# EAGLE design EEPROM-Programmer (EAGLE 9.6.2)
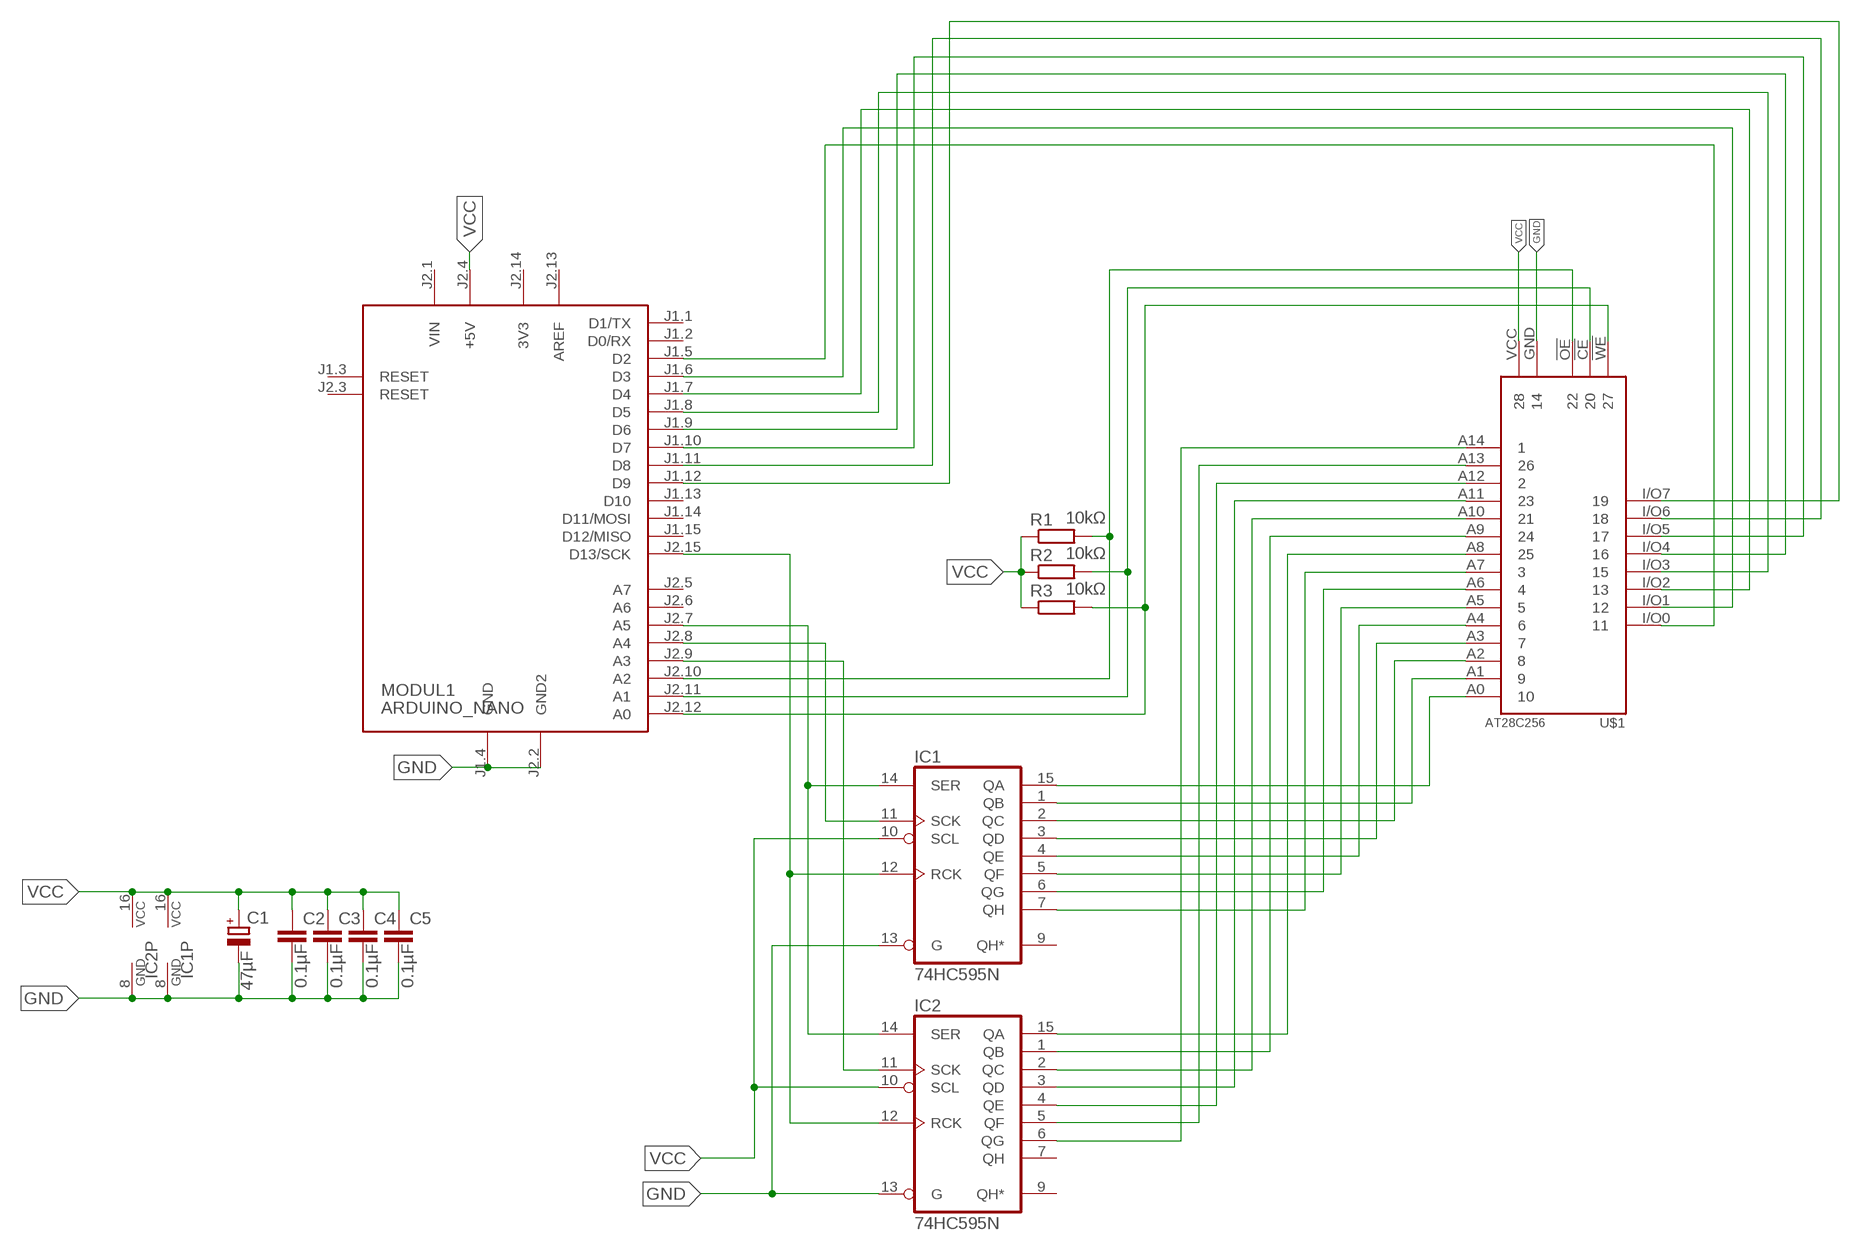
[diagram p0: schematic, sheet 1]

## Parts
C1  47µF  CPOL-EUE2,5-6E  [E2,5-6E]
C2  0.1µF  C2,5-3  [C2.5-3]
C3  0.1µF  C2,5-3  [C2.5-3]
C4  0.1µF  C2,5-3  [C2.5-3]
C5  0.1µF  C2,5-3  [C2.5-3]
IC1  74HC595N  [DIL16]
IC2  74HC595N  [DIL16]
MODUL1  ARDUINO_NANO  [ARDUINO_NANO2]
R1  10kΩ  R-EU_0204/7  [0204/7]
R2  10kΩ  R-EU_0204/7  [0204/7]
R3  10kΩ  R-EU_0204/7  [0204/7]
U$1  AT28C256  [AT28C256]

## Nets
GND: C1.- C2.2 C3.2 C4.2 C5.2 IC1.8(GND) IC1.13(G) IC2.8(GND) IC2.13(G) MODUL1.J1.4(GND) MODUL1.J2.2(GND2) U$1.GND
N$1: IC1.15(QA) U$1.A0
N$2: IC1.1(QB) U$1.A1
N$3: IC1.2(QC) U$1.A2
N$4: IC1.3(QD) U$1.A3
N$5: IC1.4(QE) U$1.A4
N$6: IC1.5(QF) U$1.A5
N$7: IC1.6(QG) U$1.A6
N$8: IC1.7(QH) U$1.A7
N$9: IC2.15(QA) U$1.A8
N$10: IC2.1(QB) U$1.A9
N$11: IC2.2(QC) U$1.A10
N$12: IC2.3(QD) U$1.A11
N$13: IC2.4(QE) U$1.A12
N$14: IC2.5(QF) U$1.A13
N$15: IC2.6(QG) U$1.A14
N$16: MODUL1.J1.5(D2) U$1.I/O0
N$17: MODUL1.J2.12(A0) R3.2 U$1.!WE
N$18: MODUL1.J1.6(D3) U$1.I/O1
N$19: MODUL1.J1.7(D4) U$1.I/O2
N$20: MODUL1.J1.8(D5) U$1.I/O3
N$21: MODUL1.J1.9(D6) U$1.I/O4
N$22: MODUL1.J1.10(D7) U$1.I/O5
N$23: MODUL1.J1.11(D8) U$1.I/O6
N$24: MODUL1.J1.12(D9) U$1.I/O7
N$25: MODUL1.J2.11(A1) R2.2 U$1.!CE
N$26: MODUL1.J2.10(A2) R1.2 U$1.!OE
N$27: IC2.11(SCK) MODUL1.J2.9(A3)
N$28: IC1.11(SCK) MODUL1.J2.8(A4)
N$29: IC1.14(SER) IC2.14(SER) MODUL1.J2.7(A5)
N$30: IC1.12(RCK) IC2.12(RCK) MODUL1.J2.15(D13/SCK)
VCC: C1.+ C2.1 C3.1 C4.1 C5.1 IC1.10(SCL) IC1.16(VCC) IC2.10(SCL) IC2.16(VCC) MODUL1.J2.4(+5V) R1.1 R2.1 R3.1 U$1.VCC
Unconnected: IC1.9(QH*) IC2.7(QH) IC2.9(QH*) MODUL1.J1.1(D1/TX) MODUL1.J1.2(D0/RX) MODUL1.J1.3(RESET) MODUL1.J1.13(D10) MODUL1.J1.14(D11/MOSI) MODUL1.J1.15(D12/MISO) MODUL1.J2.3(RESET) MODUL1.J2.5(A7) MODUL1.J2.6(A6)

## Power pins joined to a net without a drawn wire
3V3: MODUL1.J2.14(3V3)
AREF: MODUL1.J2.13(AREF)
VIN: MODUL1.J2.1(VIN)

## Library data of the parts
C1 = rcl:CPOL-EU: POLARIZED CAPACITOR, European symbol; SPICEPREFIX: C
C2-C5 = capacitor-wima:C: CAPACITOR naming: grid - package width
IC1 IC2 = 74xx-eu:74*595: 8-bit SHIFT REGISTER, output latch
MODUL1 = arduino:ARDUINO_NANO: Arduino Nano2 Auto generated by modulcreator.ulp \;; ANZAHL: 2; MODUL: TRUE; STECKX0: -76200; STECKX1: 76200; STECKY0: 177800; STECKY1: 177800
R1-R3 = rcl:R-EU_: RESISTOR, European symbol; SPICEPREFIX: R
U$1 = Dargon's_lib:AT28C256

## Board
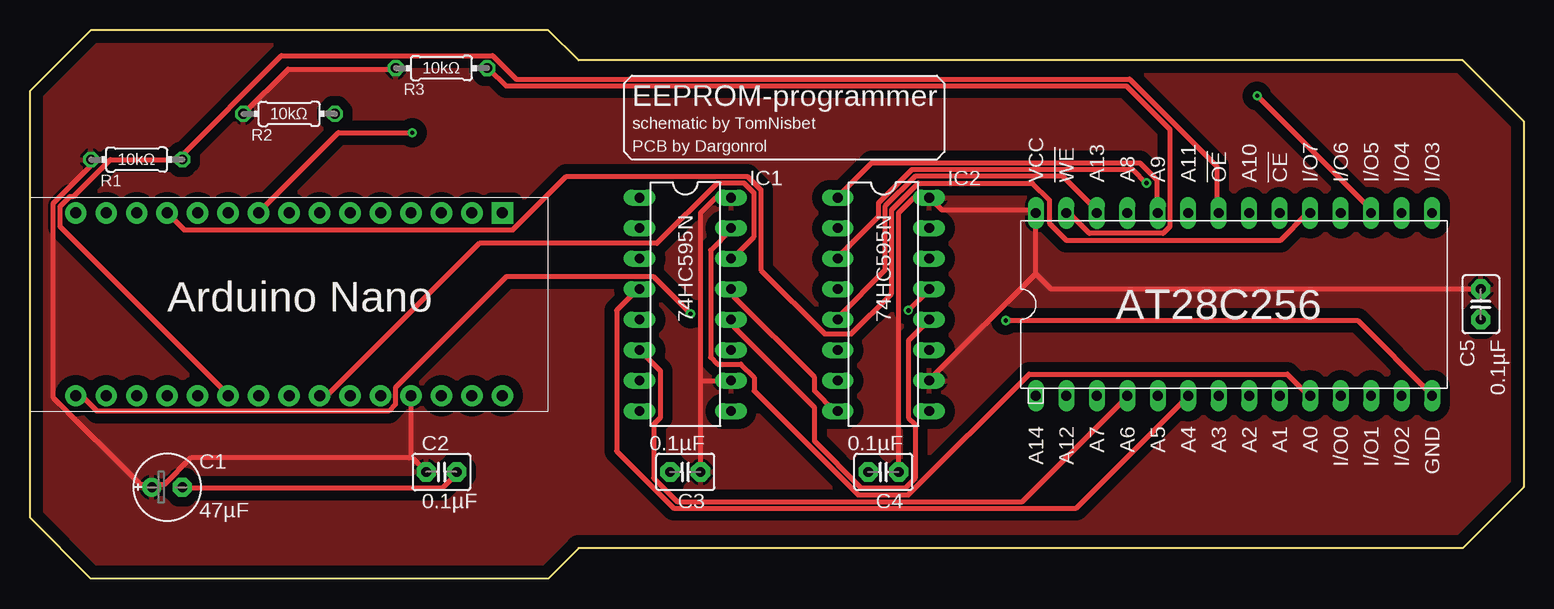
[diagram p1: board, top side]
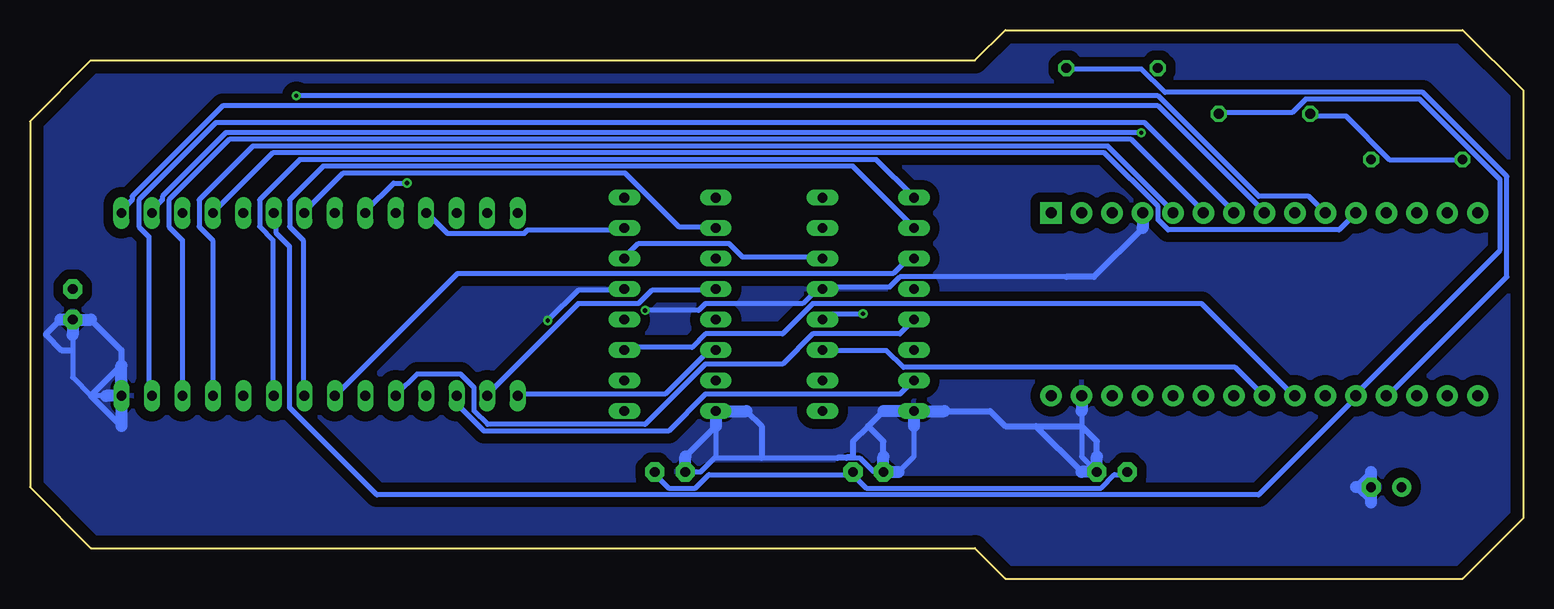
[diagram p2: board, bottom side, seen from below]

Size 124.46 x 45.72 mm. Coordinates in mm from the lower left corner, seen from the top.
Outline: 0,5.08 0,40.64 5.08,45.72 43.18,45.72 45.72,43.18 119.38,43.18 124.46,38.1 124.46,7.62 119.38,2.54 45.72,2.54 43.18,0 5.08,0 0,5.08
Copper layers (1*16): Top 0.035mm / dielectric 1.5mm / Bottom 0.035mm
Design rules "default *": minimum track width 16mil, minimum drill 0.35mm, track to track 6mil, track to pad 6mil, pad to pad 6mil, via to via 6mil, smd to smd 6mil, copper to edge 40mil, drill to drill 6mil, minimum pad ring 10mil, minimum via ring 8mil, stop-mask expansion 4mil, vias tented up to drill 0mil, thermal gap 10mil

### Footprints (pad centres in the part's own frame; a part is rotated, then mirrored left to right if it is on the bottom)
E2,5-6E = drill 0.813 pad 1.575: + -1.27,0 | drill 0.813 pad 1.575 octagon: - 1.27,0
C2.5-3 = drill 0.813 pad 1.6 octagon: 1 -1.27,0; 2 1.27,0
DIL16 = drill 0.813 long: 1 -8.89,-3.81; 2 -6.35,-3.81; 3 -3.81,-3.81; 4 -1.27,-3.81; 5 1.27,-3.81; 6 3.81,-3.81; 7 6.35,-3.81; 8 8.89,-3.81; 9 8.89,3.81; 10 6.35,3.81; 11 3.81,3.81; 12 1.27,3.81; 13 -1.27,3.81; 14 -3.81,3.81; 15 -6.35,3.81; 16 -8.89,3.81
ARDUINO_NANO2 = drill 0.914 pad 1.778 square: J1.1 -7.62,17.78 | drill 0.914 pad 1.778: J1.2 -7.62,15.24; J1.3 -7.62,12.7; J1.4 -7.62,10.16; J1.5 -7.62,7.62; J1.6 -7.62,5.08; J1.7 -7.62,2.54; J1.8 -7.62,0; J1.9 -7.62,-2.54; J1.10 -7.62,-5.08; J1.11 -7.62,-7.62; J1.12 -7.62,-10.16; J1.13 -7.62,-12.7; J1.14 -7.62,-15.24; J1.15 -7.62,-17.78; J2.1 7.62,17.78; J2.2 7.62,15.24; J2.3 7.62,12.7; J2.4 7.62,10.16; J2.5 7.62,7.62; J2.6 7.62,5.08; J2.7 7.62,2.54; J2.8 7.62,0; J2.9 7.62,-2.54; J2.10 7.62,-5.08; J2.11 7.62,-7.62; J2.12 7.62,-10.16; J2.13 7.62,-12.7; J2.14 7.62,-15.24; J2.15 7.62,-17.78
0204/7 = drill 0.813 octagon: 1 -3.81,0; 2 3.81,0
AT28C256 = drill 0.813 long: !CE 7.62,-5.08; !OE 7.62,0; !WE 7.62,12.7; A0 -7.62,-7.62; A1 -7.62,-5.08; A2 -7.62,-2.54; A3 -7.62,0; A4 -7.62,2.54; A5 -7.62,5.08; A6 -7.62,7.62; A7 -7.62,10.16; A8 7.62,7.62; A9 7.62,5.08; A10 7.62,-2.54; A11 7.62,2.54; A12 -7.62,12.7; A13 7.62,10.16; A14 -7.62,15.24; GND -7.62,-17.78; I/O0 -7.62,-10.16; I/O1 -7.62,-12.7; I/O2 -7.62,-15.24; I/O3 7.62,-17.78; I/O4 7.62,-15.24; I/O5 7.62,-12.7; I/O6 7.62,-10.16; I/O7 7.62,-7.62; VCC 7.62,15.24

### Placement (x,y rotation side)
C1  11.43,7.62 0 top
C2  34.29,8.89 0 top
C3  54.61,8.89 180 top
C4  71.12,8.89 180 top
C5  120.9,22.86 270 top
IC1  54.61,22.86 270 top
IC2  71.12,22.86 270 top
MODUL1  21.59,22.86 270 top
R1  8.89,34.92 0 top
R2  21.59,38.73 0 top
R3  34.29,42.55 0 top
U$1  99.06,22.86 90 top

### Tracks (layer width: path | path; a pad name or v marks a point on that pad's centre or on a via)
GND  (via drill 0.35)
  Top 0.406: C1.- 12.85,7.54 34.37,7.54 35.48,8.66 C2.2 | IC1.13 58.67,24.03 58.67,23.47 65.38,16.76 65.38,15.65 67.06,13.97 IC2.8 | v73.2,22.35 74.88,24.03 IC2.13 | v81.31,21.51 110.64,21.51 116.79,15.37 U$1.GND
  Bottom 0.406: 120.9,20.32 120.9,19.05 120.9,16.76 119.38,15.24 118.11,15.24 | C4.2 68.58,8.89 67.31,10.16 | 67.31,12.7 67.31,10.16 | 52.07,8.89 50.8,10.16 50.8,12.7 | v73.2,22.35 68.73,22.35 68.17,22.91 60.07,22.91 58.67,24.31 IC1.13 58.4,24.31 52.81,24.31 51.97,25.15 38.1,25.15 | 32.41,30.45 31.85,30.45 MODUL1.J1.4 | v81.31,21.51 78.79,24.03 75.16,24.03 IC2.13 | C3.2 53.37,8.94 54.2,8.94 55.32,10.06 57.15,10.06 63.5,10.06 67.33,10.06 67.31,10.16 | 36.83,13.97 36.83,12.7 36.83,10.16 C2.2
  Bottom 0.508: 31.75,29.21 35.81,25.15 38.1,25.15 | 40.64,12.7 43.18,12.7 44.45,13.97 48.26,13.97 | 40.64,12.7 36.83,12.7 35.56,11.43 35.56,10.16 | 53.34,13.97 54.61,12.7 | 54.61,12.7 55.88,11.43 55.88,10.1 56.38,10.1 56.42,10.06 57.15,10.06 | 53.34,10.16 53.34,11.43 54.61,12.7 | 69.85,10.16 67.31,12.7 | 64.77,13.97 63.5,12.7 63.5,10.06 | 116.84,12.7 119.38,15.24 116.84,17.78 116.84,19.05 119.38,21.59 | 121.92,21.59 123.11,20.4 123.11,20.32 121.84,19.05 120.9,19.05 | 12.7,6.35 13.97,7.62 12.7,8.89 | 36.83,8.89 40.64,12.7
  Bottom 1.016: MODUL1.J2.2 36.83,13.97 | IC1.8 48.26,13.97 | IC1.8 50.8,12.7 | IC1.8 53.34,13.97 | 64.77,13.97 IC2.8 67.31,12.7 | C4.2 69.85,10.16 | 53.34,10.16 C3.2 52.07,8.89 | 35.56,10.16 C2.2 36.83,8.89 | C1.- 13.97,7.62 | C1.- 12.7,8.89 | 12.7,6.35 C1.- | MODUL1.J1.4 31.75,29.21 | U$1.GND 118.11,15.24 | 116.84,16.51 U$1.GND | U$1.GND 116.84,17.78 | U$1.GND 116.84,12.7 | C5.2 119.38,21.59 | C5.2 121.92,21.59 | C5.2 120.9,20.32
  pour Bottom (isolate 0.813): -3.81,39.37 5.08,48.26 118.11,48.26 127,39.37 127,6.35 118.11,-2.54 3.81,-2.54 -3.81,5.08
N$1
  Top 0.406: U$1.A0 106.45,15.37 104.78,17.04 83.26,17.04 73.2,6.99 69.01,6.99 60.35,15.65 60.35,16.76 59.23,17.88 57.28,17.88 56.72,18.44 56.72,27.38 58.4,29.06 IC1.15
N$2
  Bottom 0.406: U$1.A1 104.22,15.37 104.22,28.22 105.33,29.34 105.33,31.57 101.98,34.92 53.92,34.92 50.85,31.85 IC1.1
N$3
  Bottom 0.406: U$1.A2 101.7,15.37 101.7,28.22 102.82,29.34 102.82,31.57 100.03,34.37 55.88,34.37 50.85,29.34 IC1.2
N$4
  Bottom 0.406: U$1.A3 98.91,15.37 88.85,25.43 52.53,25.43 51.41,26.54 50.85,26.54 IC1.3
N$5
  Top 0.406: U$1.A4 96.39,15.09 87.17,5.87 53.65,5.87 48.9,10.62 48.9,22.35 50.57,24.03 IC1.4
N$6
  Bottom 0.406: U$1.A5 93.88,15.37 92.2,17.04 88.57,17.04 87.45,15.93 87.45,13.97 86.33,12.85 73.2,12.85 68.17,17.88 61.75,17.88 59.23,20.4 51.97,20.4 50.85,21.51 IC1.5
N$7
  Top 0.406: IC1.6 52.53,17.32 52.53,13.41 51.97,12.85 51.97,8.38 53.92,6.43 82.7,6.43 91.36,15.09 U$1.A6
N$8
  Bottom 0.406: U$1.A7 88.85,15.09 88.85,14.53 86.61,12.29 71.25,12.29 68.17,15.37 51.97,15.37 50.85,16.48 IC1.7
N$9
  Bottom 0.406: IC2.15 75.16,29.06 82.98,29.06 83.26,28.78 89.69,28.78 91.36,30.45 U$1.A8
N$10
  Top 0.406: U$1.A9 93.88,30.73 93.88,33.25 92.48,34.65 70.13,34.65 67.33,31.85 IC2.1
N$11
  Bottom 0.406: IC2.2 67.33,29.34 70.41,29.34 74.88,33.81 98.35,33.81 101.42,30.73 U$1.A10
N$12  (via drill 0.35)
  Top 0.406: v93.04,32.97 91.92,34.09 73.48,34.09 70.69,31.29 70.69,30.18 67.33,26.82 IC2.3
  Bottom 0.406: v93.04,32.97 94.16,32.97 96.39,30.73 U$1.A11
N$13
  Bottom 0.406: U$1.A12 86.33,15.37 78.79,22.91 73.76,22.91 72.64,24.03 67.33,24.03 IC2.4
N$14
  Top 0.406: IC2.5 67.33,21.79 71.25,25.7 71.25,31.01 73.76,33.53 86.06,33.53 88.85,30.73 U$1.A13
N$15
  Bottom 0.406: U$1.A14 83.82,15.37 71.53,15.37 67.89,19 67.33,19 IC2.6
N$16
  Bottom 0.406: U$1.I/O0 109.25,15.37 109.25,28.22 110.36,29.34 110.36,31.57 105.89,36.04 34.65,36.04 29.34,30.73 MODUL1.J1.5
N$17
  Top 0.406: U$1.!WE 86.61,30.45 88.29,28.78 94.44,28.78 95,29.34 95,37.44 91.36,41.07 39.67,41.07 38.28,42.47 R3.2
  Bottom 0.406: R3.2 38,42.47 31.85,42.47 29.9,40.51 8.38,40.51 1.4,33.53 1.4,25.15 11.18,15.37 MODUL1.J2.12
N$18
  Bottom 0.406: U$1.I/O1 111.76,28.22 112.88,29.34 112.88,31.57 107.85,36.6 32.69,36.6 26.82,30.73 MODUL1.J1.6
N$19
  Bottom 0.406: U$1.I/O2 114.55,15.37 114.55,28.5 115.39,29.34 115.39,31.57 108.97,38 31.57,38 24.31,30.73 MODUL1.J1.7
N$20
  Bottom 0.406: U$1.I/O3 116.79,30.73 115.95,31.57 115.95,31.85 108.41,39.4 30.45,39.4 21.79,30.73 MODUL1.J1.8
N$21  (via drill 0.35)
  Top 0.406: v31.85,37.16 25.7,37.16 19.28,30.73 MODUL1.J1.9
  Bottom 0.406: v31.85,37.16 108.13,37.16 113.44,31.85 113.44,31.57 114.28,30.73 U$1.I/O4
N$22  (via drill 0.35)
  Top 0.406: v102.26,40.23 111.76,30.73 U$1.I/O5
  Bottom 0.406: v102.26,40.23 30.45,40.23 22.07,31.85 17.88,31.85 MODUL1.J1.10
N$23
  Bottom 0.406: U$1.I/O6 104.22,35.48 34.92,35.48 30.45,31.01 30.45,29.9 29.62,29.06 15.37,29.06 13.97,30.45 MODUL1.J1.11
N$24
  Top 0.406: MODUL1.J1.12 12.85,29.06 40.23,29.06 44.7,33.53 59.79,33.53 60.91,32.41 60.91,25.7 66.22,20.4 68.45,20.4 71.81,23.75 71.81,30.73 74.04,32.97 83.54,32.97 84.94,31.57 84.94,29.62 86.33,28.22 104.22,28.22 106.45,30.45 U$1.I/O7
N$25
  Bottom 0.406: R2.2 25.15,38.84 19.28,38.84 18.16,39.95 8.66,39.95 1.96,33.25 1.96,27.38 13.97,15.37 MODUL1.J2.11 13.97,15.09 22.07,6.99 95.56,6.99 102.82,14.25 102.82,27.66 103.94,28.78 103.94,30.45 U$1.!CE
N$26
  Top 0.406: 12.29,34.92 6.71,34.92 3.63,31.85 3.35,31.85 2.52,31.01 2.52,29.34 16.48,15.37 MODUL1.J2.10 | 12.29,34.92 R1.2 | 12.29,34.92 20.95,43.59 38.56,43.59 40.51,41.63 91.64,41.63 98.91,34.37 98.91,30.73 U$1.!OE
N$27
  Bottom 0.406: IC2.11 74.88,19.28 69.29,19.28 68.17,20.4 61.75,20.4 59.23,22.91 26.82,22.91 19.28,15.37 MODUL1.J2.9
N$28
  Bottom 0.406: IC1.11 58.4,19 53.09,19 51.69,17.6 24.03,17.6 21.79,15.37 MODUL1.J2.8
N$29
  Top 0.406: MODUL1.J2.7 24.31,15.37 24.87,15.37 37.44,27.94 52.25,27.94 57.28,32.97 59.51,32.97 60.35,32.13 60.35,28.5 58.67,26.82 IC1.14
  Bottom 0.406: IC1.14 58.67,26.82 65.1,26.82 66.22,27.94 73.76,27.94 74.88,26.82 IC2.14
N$30  (via drill 0.35)
  Top 0.406: IC1.12 58.67,21.51 58.67,20.95 65.38,14.25 65.38,11.46 69.29,7.54 72.92,7.54 73.76,8.38 73.76,12.85 73.2,13.41 73.2,19.84 74.88,21.51 IC2.12 | v55.04,22.07 51.97,25.15 39.67,25.15 30.45,15.93 30.45,14.53 29.9,13.97 5.59,13.97 4.47,15.09 3.91,15.09 MODUL1.J2.15
  Bottom 0.406: v55.04,22.07 58.12,22.07 58.4,21.79 IC1.12
VCC
  Top 0.406: C2.1 31.75,10.16 | 31.75,10.16 MODUL1.J2.4 | C5.1 85.09,24.13 83.82,25.4 83.82,25.43 | 83.82,25.43 U$1.VCC 83.82,30.73 76,30.73 75.16,31.57 IC2.16 73.66,31.75 72.39,30.48 C4.1 | C3.1 55.88,16.48 | 55.88,16.48 55.88,30.48 57.15,31.75 IC1.16 | R2.1 21.51,42.47 30.45,42.47 R3.1 | 31.75,10.16 31.57,10.06 13.41,10.06 11.18,7.82 10.34,7.82 C1.+ 10.06,7.82 9.22,7.82 1.96,15.09 1.96,31.29 5.03,34.37 5.03,34.92 R1.1 | 83.82,25.43 75.16,16.76 IC2.10 | 55.88,16.48 58.4,16.48 IC1.10
  Bottom 0.406: R1.1 11.18,34.92 14.81,38.56 17.6,38.56 R2.1 | 55.88,8.66 67.89,8.66 69.01,7.54 71.25,7.54 72.36,8.66 C4.1 | 55.88,8.66 54.76,7.54 35.2,7.54 34.09,8.66 33.25,8.66 C2.1 | 55.88,8.66 C3.1
  pour Top (isolate 0.813): -2.54,40.64 5.08,48.26 7.62,48.26 118.11,48.26 127,39.37 127,6.35 118.11,-2.54 3.81,-2.54 -3.81,5.08 -3.81,39.37

### Text on the board
tPlace: EEPROM-programmer | schematic by TomNisbet | PCB by Dargonrol | Arduino Nano